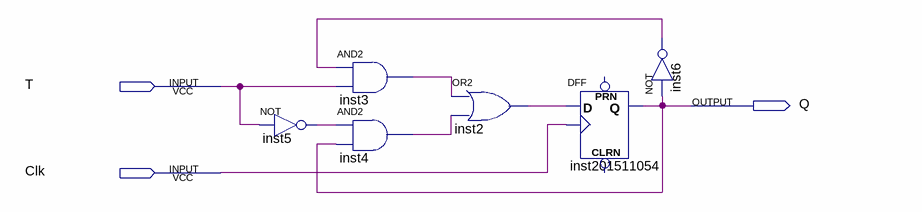
[diagram p0: schematic sheet]
// Quartus schematic lab05_3.bdf as structural Verilog: 6 symbols, 3 pins
module lab05_3 (
  input  T,
  input  Clk,
  output Q
);

  wire inst2_out, inst3_out, inst4_out, inst5_out, inst6_out;

  not inst5 (inst5_out, T);
  and inst3 (inst3_out, inst6_out, T);
  and inst4 (inst4_out, inst5_out, Q);
  or inst2 (inst2_out, inst3_out, inst4_out);
  DFF inst201511054 (.CLK(Clk), .D(inst2_out), .Q(Q));  // open: CLRN, PRN
  not inst6 (inst6_out, Q);
endmodule
